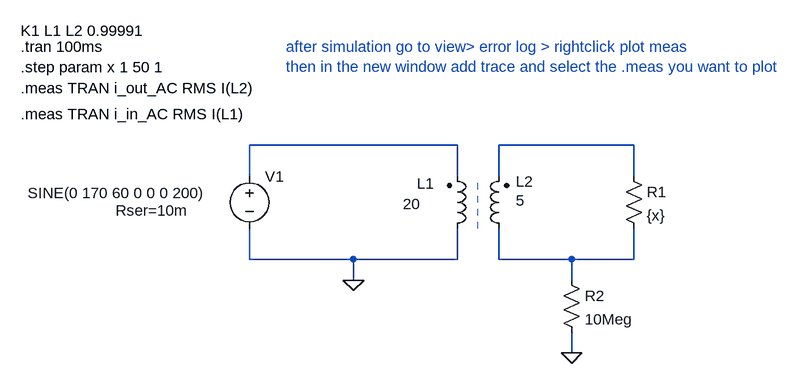
[diagram p0: schematic TransformerOutPutImpedance.asc]
TransformerOutPutImpedance.asc, the LTspice schematic file:
Version 4
SHEET 1 880 680
WIRE 192 80 -128 80
WIRE 464 80 256 80
WIRE -128 128 -128 80
WIRE 192 128 192 80
WIRE 256 128 256 80
WIRE 464 128 464 80
WIRE -128 256 -128 208
WIRE 32 256 -128 256
WIRE 192 256 192 208
WIRE 192 256 32 256
WIRE 256 256 256 208
WIRE 368 256 256 256
WIRE 464 256 464 208
WIRE 464 256 368 256
WIRE 32 288 32 256
WIRE 368 288 368 256
WIRE 368 400 368 368
FLAG 368 400 0
FLAG 32 288 0
SYMBOL ind2 176 224 M180
WINDOW 0 -46 85 Left 2
WINDOW 3 -68 53 Left 2
SYMATTR InstName L1
SYMATTR Value 20
SYMATTR Type ind
SYMATTR SpiceLine Rser=100m Rpar=1Meg
SYMBOL ind2 272 224 R180
WINDOW 0 -37 88 Left 2
WINDOW 3 -24 59 Left 2
SYMATTR InstName L2
SYMATTR Value 5
SYMATTR Type ind
SYMATTR SpiceLine Rser=20m Rpar=1Meg
SYMBOL voltage -128 112 R0
WINDOW 3 -341 42 Left 2
WINDOW 123 0 0 Left 0
WINDOW 39 -206 69 Left 2
SYMATTR InstName V1
SYMATTR Value SINE(0 170 60 0 0 0 200)
SYMATTR SpiceLine Rser=10m
SYMBOL res 448 112 R0
SYMATTR InstName R1
SYMATTR Value {x}
SYMBOL res 352 272 R0
SYMATTR InstName R2
SYMATTR Value 10Meg
TEXT -480 -96 Left 2 !K1 L1 L2 0.99991
TEXT -480 -40 Left 2 !.step param x 1 50 1
TEXT -480 -72 Left 2 !.tran 100ms
TEXT -480 -8 Left 2 !.meas TRAN i_out_AC RMS I(L2)
TEXT -480 32 Left 2 !.meas TRAN i_in_AC RMS I(L1)
TEXT -72 -72 Left 2 ;after simulation go to view> error log > rightclick plot meas\nthen in the new window add trace and select the .meas you want to plot
LINE Normal 224 208 224 128 2

The netlist it stands for:
* TransformerOutPutImpedance.asc
L1 0 N001 20 Rser=100m Rpar=1Meg
L2 N003 N002 5 Rser=20m Rpar=1Meg
V1 N001 0 SINE(0 170 60 0 0 0 200) Rser=10m
R1 N002 N003 {x}
R2 N003 0 10Meg
K1 L1 L2 0.99991
.step param x 1 50 1
.tran 100ms
.meas TRAN i_out_AC RMS I(L2)
.meas TRAN i_in_AC RMS I(L1)
* after simulation go to view> error log > rightclick plot meas
* then in the new window add trace and select the .meas you want to plot
.backanno
.end